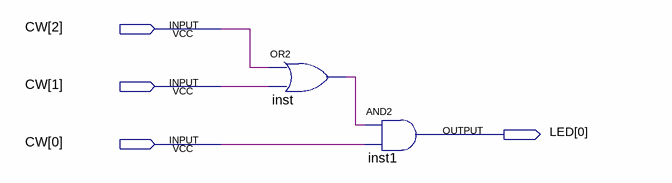
[diagram p0: schematic sheet]
// Quartus schematic ex2.bdf as structural Verilog: 2 symbols, 4 pins
module ex2 (
  input  [2:0] CW,
  output [0:0] LED
);

  wire inst_out;

  or inst (inst_out, CW[2], CW[1]);
  and inst1 (LED[0], inst_out, CW[0]);
endmodule
